# Altium project UmTRXv2_RxSel.PRJPCB
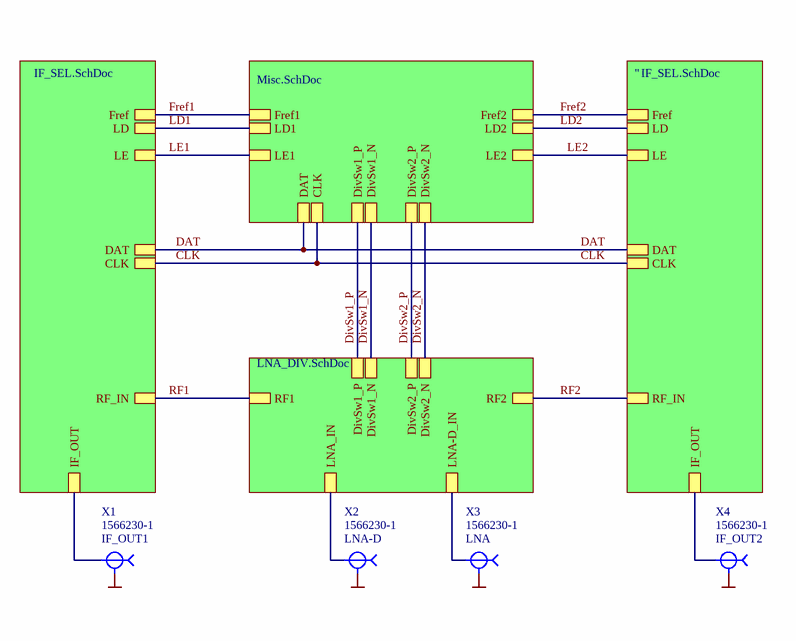
[diagram p0: Total.SCHDOC]
4 sheets, 225 parts. Net scope: hierarchical (ports join the sheet entries above them; power ports are global).
Board file: UmTRXv2_RxSel.PcbDoc
Sheets:
  Total.SCHDOC
     = Misc.SchDoc
    " = IF_SEL.SchDoc
     = IF_SEL.SchDoc
     = LNA_DIV.SchDoc

## Sheet Total.SCHDOC
size A4 portrait; CompanyName: FairWaves LLC; DrawnBy: Andrey Sviyazov; DocumentNumber: 1; Revision: 1; SheetNumber: 1; SheetTotal: 5; PageSetup: Record=PageOptionsZCenterHorizontal=TrueZCenterVertical=TrueZPrintScale=0.71ZXCorrection=1.00ZYCorrection=1.00ZPrintKind=2ZBorderSize=5000000ZLeftOffset=0ZBottomOffset=0ZOrientation=1ZPaperLength=1000ZPaperWidth=1000ZScale=100ZPaperSource=7ZPrintQuality=-4ZMediaType=1ZDitherType=10ZPaperKind=A4ZPrintScaleMode=1

### Parts
X1  1566230-1  Dscription: IF_OUT1  [U_FL]
X2  1566230-1  Dscription: LNA-D  [U_FL]
X3  1566230-1  Dscription: LNA  [U_FL]
X4  1566230-1  Dscription: IF_OUT2  [U_FL]

### Sub-sheets
" = IF_SEL.SchDoc: DAT, CLK, LE, Fref, LD, RF_IN, IF_OUT
? = Misc.SchDoc: DAT, CLK, LE1, Fref1, LD1, DivSw1_P, DivSw1_N, DivSw2_N, DivSw2_P, LE2, Fref2, LD2
? = IF_SEL.SchDoc: DAT, CLK, LE, Fref, LD, RF_IN, IF_OUT
? = LNA_DIV.SchDoc: DivSw2_P, DivSw1_N, DivSw1_P, RF1, RF2, DivSw2_N, LNA_IN, LNA-D_IN

### Nets
GND: X1.2(GND) X2.2(GND) X3.2(GND) X4.2(GND)
CLK: sheet /CLK, sheet "/CLK, sheet /CLK
DAT: sheet /DAT, sheet "/DAT, sheet /DAT
DivSw1_N: sheet /DivSw1_N, sheet /DivSw1_N
DivSw1_P: sheet /DivSw1_P, sheet /DivSw1_P
DivSw2_N: sheet /DivSw2_N, sheet /DivSw2_N
DivSw2_P: sheet /DivSw2_P, sheet /DivSw2_P
Fref1: sheet /Fref1, sheet /Fref
Fref2: sheet /Fref2, sheet "/Fref
IF_OUT: X1.1 ; sheet /IF_OUT
IF_OUT: X4.1 ; sheet "/IF_OUT  [a separate net that carries the same name]
LD1: sheet /LD1, sheet /LD
LD2: sheet /LD2, sheet "/LD
LE1: sheet /LE1, sheet /LE
LE2: sheet /LE2, sheet "/LE
LNA-D_IN: X3.1 ; sheet /LNA-D_IN
LNA_IN: X2.1 ; sheet /LNA_IN
RF1: sheet /RF_IN, sheet /RF1
RF2: sheet "/RF_IN, sheet /RF2

### Library data of the parts
X1-X4 = U_FL: Connector (UMCC); Manufacturer: Tyco Electronics Corp; Name: 1566230-1

## Sheet Misc.SchDoc
size A4 portrait; CompanyName: FairWaves LLC; DrawnBy: Andrey Sviyazov; DocumentNumber: 2; Revision: 1; SheetNumber: 2; SheetTotal: 5
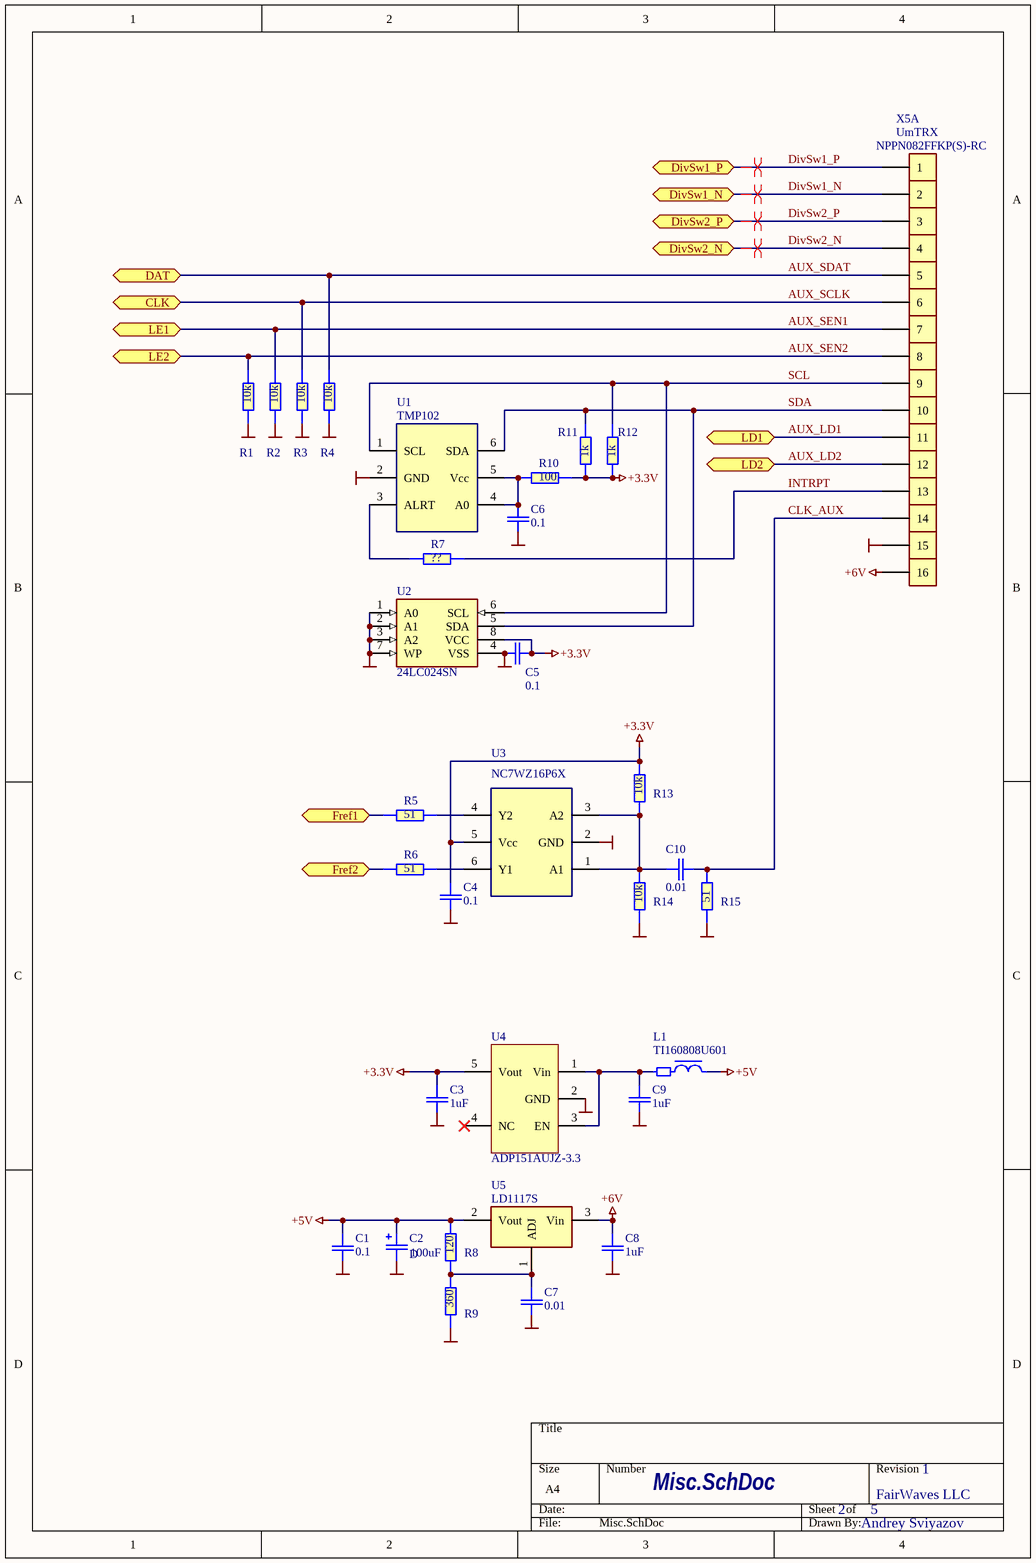
[diagram p1: Misc.SchDoc]

### Parts
C1  0.1  [C0603-Phillips]
C2  100uF  [cd7343]
C3  1uF  [C0603-Phillips]
C4  0.1  [C0603-Phillips]
C5  0.1  [C0603-Phillips]
C6  0.1  [C0603-Phillips]
C7  0.01  [C0603-Phillips]
C8  1uF  [C0603-Phillips]
C9  1uF  [C0603-Phillips]
C10  0.01  [C0603-Phillips]
L1  TI160808U601  [Ti160808-Phillips]
R1  10k  [R0603-PHILLIPS]
R2  10k  [R0603-PHILLIPS]
R3  10k  [R0603-PHILLIPS]
R4  10k  [R0603-PHILLIPS]
R5  51  [R0603-PHILLIPS]
R6  51  [R0603-PHILLIPS]
R7  ??  [R0603-PHILLIPS]
R8  120  [R0603-PHILLIPS]
R9  360  [R0603-PHILLIPS]
R10  100  [R0603-PHILLIPS]
R11  1k  [R0603-PHILLIPS]
R12  1k  [R0603-PHILLIPS]
R13  10k  [R0603-PHILLIPS]
R14  10k  [R0603-PHILLIPS]
R15  51  [R0603-PHILLIPS]
U1  TMP102  [PDSO-G6]
U2  24LC024SN  [SOIC8]
U3  NC7WZ16P6X  [SC70-6LD(SOT363)]
U4  ADP151AUJZ-3.3  [SOT-23-5[3.1x1.8/0.95]]
U5  LD1117S  [SOT-223-1]
X5  NPPN082FFKP(S)-RC  Misc: UmTRX  [NPPN082FFKP(S)]  (parts A,B,C,D,E,F,G,H,I,J,K,L,M,N,O,P of 16)

### Ports
CLK, DAT, DivSw1_N, DivSw1_P, DivSw2_N, DivSw2_P, Fref1, Fref2, LD1, LD2, LE1, LE2

### Nets
+3.3V: C3.2 C4.2 C5.2 R10.2 R11.1 R12.1 R13.1 U2.8(VCC) U3.5(Vcc) U4.5(Vout)
+5V: C1.2 C2.1(+) L1.1 R8.1 U5.2(Vout)
+6V: C8.2 U5.3(Vin) X5.16
GND: C1.1 C2.2(-) C3.1 C4.1 C5.1 C6.1 C7.1 C8.1 C9.1 R1.1 R2.1 R3.1 R4.1 R9.2 R14.2 R15.2 U1.2(GND) U2.1(A0) U2.2(A1) U2.3(A2) U2.4(VSS) U2.7(WP) U3.2(GND) U4.2(GND) X5.15
AUX_LD1: X5.11 ; port LD1  [project net LD1]
AUX_LD2: X5.12 ; port LD2  [project net LD2]
AUX_SCLK: R3.2 X5.6 ; port CLK  [project net CLK]
AUX_SDAT: R4.2 X5.5 ; port DAT  [project net DAT]
AUX_SEN1: R2.2 X5.7 ; port LE1  [project net LE1]
AUX_SEN2: R1.2 X5.8 ; port LE2  [project net LE2]
CLK_AUX: C10.1 R15.1 X5.14
DivSw1_N: X5.2 ; port DivSw1_N
DivSw1_P: X5.1 ; port DivSw1_P
DivSw2_N: X5.4 ; port DivSw2_N
DivSw2_P: X5.3 ; port DivSw2_P
Fref1: R5.1 ; port Fref1
Fref2: R6.1 ; port Fref2
INTRPT: R7.2 X5.13
SCL: R12.2 U1.1(SCL) U2.6(SCL) X5.9
SDA: R11.2 U1.6(SDA) U2.5(SDA) X5.10
NetC6_2: C6.2 R10.1 U1.4(A0) U1.5(Vcc)
NetC7_2: C7.2 R8.2 R9.1 U5.1(ADJ)
NetC9_2: C9.2 L1.2 U4.1(Vin) U4.3(EN)
NetC10_2: C10.2 R13.2 R14.1 U3.1(A1) U3.3(A2)
NetR5_2: R5.2 U3.4(Y2)
NetR6_2: R6.2 U3.6(Y1)
NetR7_1: R7.1 U1.3(ALRT)

Not connected (* = marked no-connect by the designer): U4 4(NC)*

### Layout directives
differential pair: DivSw1_N, DivSw1_P, DivSw2_N, DivSw2_P

### Notes on the sheet
- (in symbol CD7343) D

### Library data of the parts
C1 C3-C10 = C0603: Capacitor; Manufacturer: MURATA; Tolerance: 20%; Name: SMD0603; U/P/TKE: Y5V
  C1 C4-C6: Value: 0.1
  C3 C8 C9: Value: 1uF
  C7 C10: Value: 0.01
C2 = CD7343: Capacitor; Manufacturer: SPRAGUE; Name: CASE-D; U/P/TKE: 16V; Value: 100uF
L1 = TI160808: Choke; Manufacturer: MURATA; Name: TI160808U601; Value: *
R1-R15 = R0603: Resistor; Manufacturer: YAGEO; Tolerance: 5%; Name: SMD0603; U/P/TKE: 0.1W
  R1-R4 R13 R14: Value: 10k
  R5 R6 R15: Value: 51
  R7: Value: ??
  R8: Value: 120
  R9: Value: 360
  R10: Value: 100
  R11 R12: Value: 1k
U1 = TMP102: IC; Manufacturer: TI; Misc: Temperature Sensor I2C; Name: TMP102
U2 = AT24CXX: EEPROM; Manufacturer: Microchip; Swap: No; Name: 24LC024SN
U3 = NC7WZ16P6X: IC; Manufacturer: Fairchild; Name: NC7WZ16P6X
U4 = ADP151AUJZ: IC; Manufacturer: AD; Name: ADP151AUJZ-3.3
U5 = LD1117ADJ: IC; Manufacturer: STMicro; Swap: No; Name: LD1117S
X5 = NPPN082FFKP(S): Connector female 2mm SMD; Manufacturer: Sullins; Name: NPPN082FFKP(S)-RC

## Sheet IF_SEL.SchDoc
size A4 portrait; CompanyName: FairWaves LLC; DrawnBy: Andrey Sviyazov; DocumentNumber: 4; Revision: 1; SheetNumber: 4; SheetTotal: 5
Used 2 times, as channels ", . Parts and nets are listed once, with the designators drawn on the sheet.
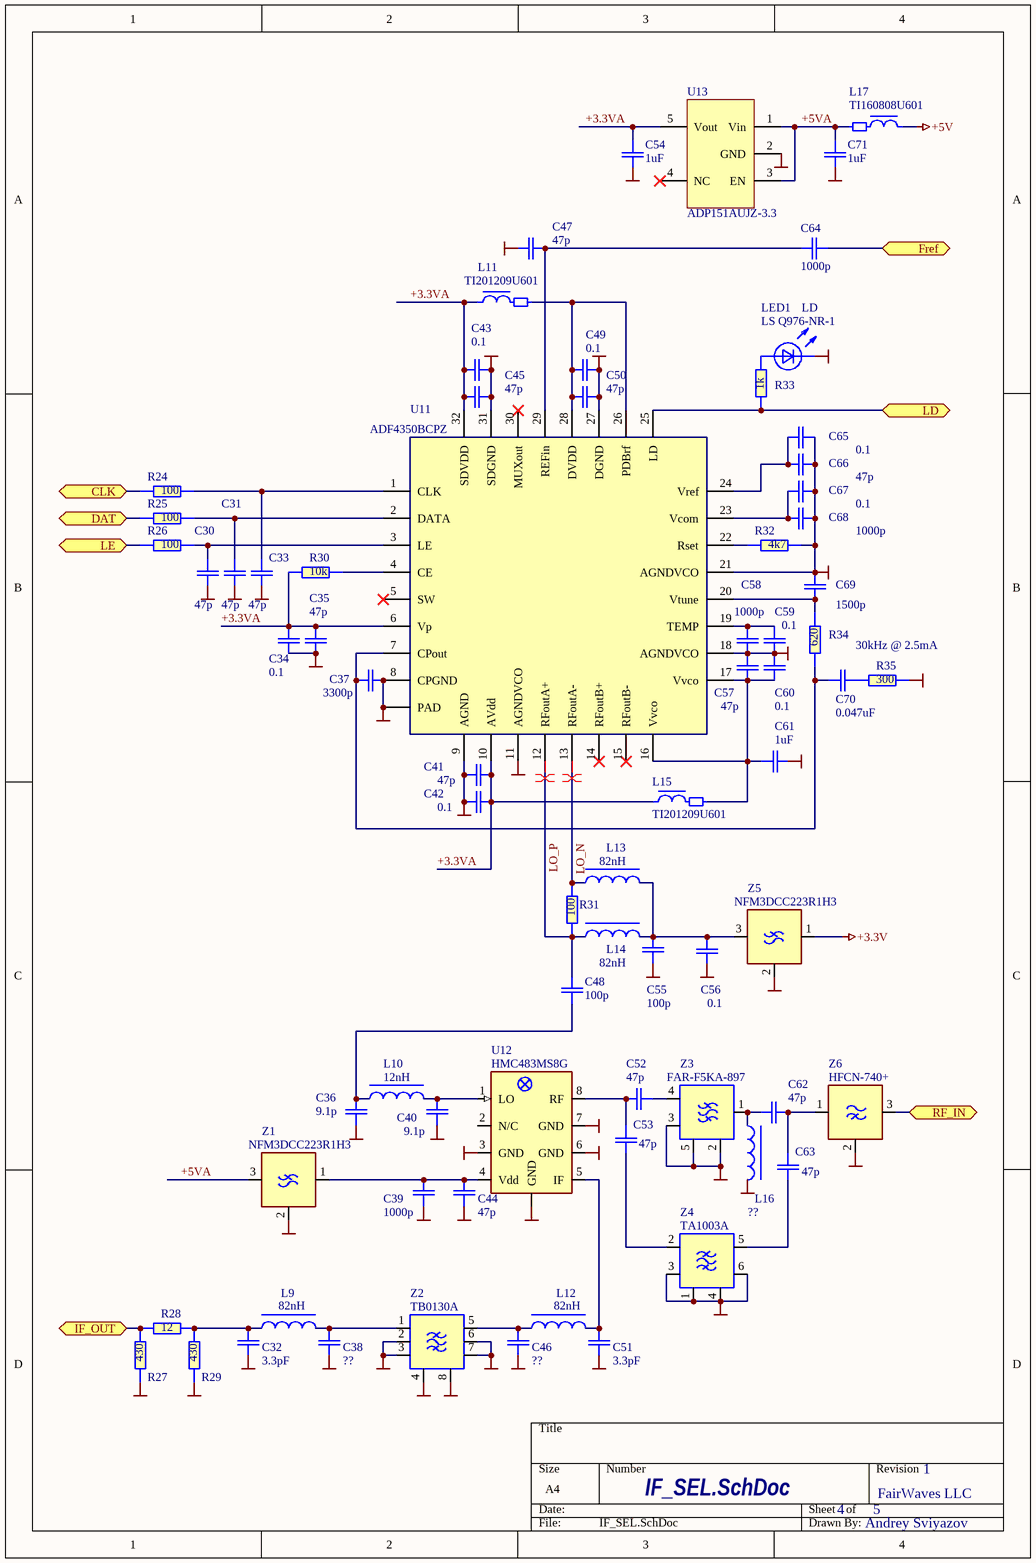
[diagram p2: IF_SEL.SchDoc]

### Parts
C30  47p  [C0603-Phillips]
C31  47p  [C0603-Phillips]
C32  3.3pF  [C0603-Phillips]
C33  47p  [C0603-Phillips]
C34  0.1  [C0603-Phillips]
C35  47p  [C0603-Phillips]
C36  9.1p  [C0603-Phillips]
C37  3300p  [C0603-Phillips]
C38  ??  [C0603-Phillips]
C39  1000p  [C0603-Phillips]
C40  9.1p  [C0603-Phillips]
C41  47p  [C0603-Phillips]
C42  0.1  [C0603-Phillips]
C43  0.1  [C0603-Phillips]
C44  47p  [C0603-Phillips]
C45  47p  [C0603-Phillips]
C46  ??  [C0603-Phillips]
C47  47p  [C0603-Phillips]
C48  100p  [C0603-Phillips]
C49  0.1  [C0603-Phillips]
C50  47p  [C0603-Phillips]
C51  3.3pF  [C0603-Phillips]
C52  47p  [C0603-Phillips]
C53  47p  [C0603-Phillips]
C54  1uF  [C0603-Phillips]
C55  100p  [C0603-Phillips]
C56  0.1  [C0603-Phillips]
C57  47p  [C0603-Phillips]
C58  1000p  [C0603-Phillips]
C59  0.1  [C0603-Phillips]
C60  0.1  [C0603-Phillips]
C61  1uF  [C0603-Phillips]
C62  47p  [C0603-Phillips]
C63  47p  [C0603-Phillips]
C64  1000p  [C0603-Phillips]
C65  0.1  [C0603-Phillips]
C66  47p  [C0603-Phillips]
C67  0.1  [C0603-Phillips]
C68  1000p  [C0603-Phillips]
C69  1500p  [C0603-Phillips]
C70  0.047uF  [C0603-Phillips]
C71  1uF  [C0603-Phillips]
L9  82nH  [TF160808-Phillips]
L10  12nH  [TF160808-Phillips]
L11  TI201209U601  [TI2012-Phillips]
L12  82nH  [TF160808-Phillips]
L13  82nH  [TF160808-Phillips]
L14  82nH  [TF160808-Phillips]
L15  TI201209U601  [TI2012-Phillips]
L16  ??  [TF160808-Phillips]
L17  TI160808U601  [Ti160808-Phillips]
LED1  LS Q976-NR-1  Misc: LD  [LED-0603y]
R24  100  [R0603-PHILLIPS]
R25  100  [R0603-PHILLIPS]
R26  100  [R0603-PHILLIPS]
R27  430  [R0603-PHILLIPS]
R28  12  [R0603-PHILLIPS]
R29  430  [R0603-PHILLIPS]
R30  10k  [R0603-PHILLIPS]
R31  100  [R0603-PHILLIPS]
R32  4k7  [R0603-PHILLIPS]
R33  1k  [R0603-PHILLIPS]
R34  620  [R0603-PHILLIPS]
R35  300  [R0603-PHILLIPS]
U11  ADF4350BCPZ  [CP-32-2]
U12  HMC483MS8G  [MS8G]
U13  ADP151AUJZ-3.3  [SOT-23-5[3.1x1.8/0.95]]
Z1  NFM3DCC223R1H3  [NFM3DC]
Z2  TB0130A  [DCC8_5x5]
Z3  FAR-F5KA-897  [SAW-1.4x1x0.5mm]
Z4  TA1003A  [DCC6C_L]
Z5  NFM3DCC223R1H3  [NFM3DC]
Z6  HFCN-740+  [LFCN-HFCN]

### Ports
CLK, DAT, Fref, IF_OUT, LD, LE, RF_IN

### Nets
+3.3V: Z5.1
+5V: L17.1
GND: C30.1 C31.1 C32.1 C33.1 C34.1 C35.1 C36.2 C37.1 C38.1 C39.2 C40.2 C41.2 C42.2 C43.2 C44.2 C45.2 C46.1 C47.1 C49.2 C50.2 C51.1 C54.1 C55.2 C56.1 C57.2 C58.1 C59.1 C60.2 C61.1 C65.2 C66.2 C67.2 C68.2 C69.2 C71.1 L16.2 LED1.1(K) R27.1 R29.1 R32.2 R35.2 U11.0(PAD) U11.8(CPGND) U11.9(AGND) U11.11(AGNDVCO) U11.18(AGNDVCO) U11.21(AGNDVCO) U11.27(DGND) U11.31(SDGND) U12.0(GND) U12.3(GND) U12.6(GND) U12.7(GND) U13.2(GND) Z1.2 Z2.2(In2) Z2.3(In3) Z2.4(Gnd) Z2.6(Out2) Z2.7(Out3) Z2.8(Gnd) Z3.2(GND) Z3.3(~{Out}) Z3.5(GND) Z4.1(GND) Z4.3(GND) Z4.4(GND) Z4.6(GND) Z5.2 Z6.2
+3.3VA: C34.2 C35.2 C41.1 C42.1 C43.1 C45.1 C54.2 L11.1 L15.1 R30.1 U11.6(Vp) U11.10(AVdd) U11.32(SDVDD) U13.5(Vout)
+5VA: C71.2 L17.2 U13.1(Vin) U13.3(EN) Z1.3
CLK: R24.1 ; port CLK
DAT: R25.1 ; port DAT
Fref: C64.2 ; port Fref
IF_OUT: R27.2 R28.1 ; port IF_OUT
LD: R33.1 U11.25(LD) ; port LD
LE: R26.1 ; port LE
LO_N: L13.1 R31.2 U11.13(RFoutA-)
LO_P: C48.1 L14.1 R31.1 U11.12(RFoutA+)
RF_IN: Z6.3 ; port RF_IN
NetC30_2: C30.2 R26.2 U11.3(LE)
NetC31_2: C31.2 R25.2 U11.2(DATA)
NetC32_2: C32.2 L9.1 R28.2 R29.2
NetC33_2: C33.2 R24.2 U11.1(CLK)
NetC36_1: C36.1 C48.2 L10.2
NetC37_2: C37.2 C70.2 R34.1 U11.7(CPout)
NetC38_2: C38.2 L9.2 Z2.1(IN1)
NetC39_1: C39.1 C44.1 U12.4(Vdd) Z1.1
NetC40_1: C40.1 L10.1 U12.1(LO)
NetC46_2: C46.2 L12.1 Z2.5(Out1)
NetC47_2: C47.2 C64.1 U11.29(REFin)
NetC49_1: C49.1 C50.1 L11.2 U11.26(PDBrf) U11.28(DVDD)
NetC51_2: C51.2 L12.2 U12.5(IF)
NetC52_1: C52.1 C53.2 U12.8(RF)
NetC52_2: C52.2 Z3.4(Out)
NetC53_1: C53.1 Z4.2(IN)
NetC55_1: C55.1 C56.2 L13.2 L14.2 Z5.3
NetC57_1: C57.1 C60.1 C61.2 L15.2 U11.16(Vvco) U11.17(Vvco)
NetC58_2: C58.2 C59.2 U11.19(TEMP)
NetC62_1: C62.1 L16.1 Z3.1(IN)
NetC62_2: C62.2 C63.2 Z6.1
NetC63_1: C63.1 Z4.5(Out)
NetC65_1: C65.1 C66.1 U11.24(Vref)
NetC67_1: C67.1 C68.1 U11.23(Vcom)
NetC69_1: C69.1 R34.2 U11.20(Vtune)
NetC70_1: C70.1 R35.1
NetLED1_2: LED1.2(A) R33.2
NetR30_2: R30.2 U11.4(CE)
NetR32_1: R32.1 U11.22(Rset)

Not connected (* = marked no-connect by the designer): U11 5(SW)* 14(RFoutB+)* 15(RFoutB-)* 30(MUXout)*; U12 2(N/C); U13 4(NC)*

### Channels
": designators end in -1; ports CLK=CLK DAT=DAT Fref=Fref2 IF_OUT=IF_OUT LD=LD2 LE=LE2 RF_IN=RF2
(top): designators end in -2; ports CLK=CLK DAT=DAT Fref=Fref1 IF_OUT=IF_OUT LD=LD1 LE=LE1 RF_IN=RF1

### Layout directives
differential pair: LO_N_", LO_P_"

### Notes on the sheet
- 30kHz @ 2.5mA

### Library data of the parts
C30-C33 C35-C41 C44-C48 C50-C53 C55 C57 C58 C62-C64 C66 C68 C69 = C0603: Capacitor; Manufacturer: MURATA; Tolerance: 20%; Name: SMD0603; U/P/TKE: NP0
  C30 C31 C33 C35 C41 C44 C45 C47 C50 C52 C53 C57 C62 C63 C66: Value: 47p
  C32 C51: Value: 3.3pF
  C36 C40: Value: 9.1p
  C37: Value: 3300p
  C38 C46: Value: ??
  C39 C58 C64 C68: Value: 1000p
  C48 C55: Value: 100p
  C69: Value: 1500p
C34 C42 C43 C49 C54 C56 C59-C61 C65 C67 C71 = C0603: as C1 on sheet Misc
  C34 C42 C43 C49 C56 C59 C60 C65 C67: Value: 0.1
  C54 C61 C71: Value: 1uF
C70 = C0603: Capacitor; Manufacturer: MURATA; Tolerance: 20%; Name: SMD0603; U/P/TKE: X5R; Value: 0.047uF
L9 L10 L12-L14 L16 = TF160808: Coil; Manufacturer: SMD; Name: TF160808
  L9 L12-L14: Value: 82nH
  L10: Value: 12nH
  L16: Value: ??
L11 L15 = TI2012_1: Choke; Manufacturer: MURATA; Name: TI201209U601; Value: *
L17 = TI160808: Choke; Manufacturer: MURATA; Name: TI160808U601; Value: *
LED1 = LED0603: LED SMD; Manufacturer: OSRAM Opto Semi; Name: LS Q976-NR-1
R24-R35 = R0603: as R1 on sheet Misc
  R24-R26 R31: Value: 100
  R27 R29: Value: 430
  R28: Value: 12
  R30: Value: 10k
  R32: Value: 4k7
  R33: Value: 1k
  R34: Value: 620
  R35: Value: 300
U11 = ADF4350BCPZ: IC; Manufacturer: Analog Devices; Misc: RF Synthesizer with VCO; Swap: No; Name: ADF4350BCPZ
U12 = HMC483_5MS8G: IC; Manufacturer: Hittite; Swap: No; Misc: High IP3 Mixer with  LO Amp; Name: HMC483MS8G
U13 = ADP151AUJZ: IC; Manufacturer: AD; Name: ADP151AUJZ-3.3
Z1 Z5 = NFM3DC: EMI_FILTER; Manufacturer: Murata; Value: 22nF; PDF: D:\Proj\Components\Murata\EMI Suppression Filters.pdf; Name: NFM3DCC223R1H3; Misc: EMI_FILTER
Z2 = SAW 5x5-8 SMD: SAW filter; Manufacturer: Tai-SAW; Misc: Low-Loss IF Filter for Mobile Communication; Name: TB0130A
Z3 = SAW 1.4x1.0-5 SMD: SAW Filter; Manufacturer: Taiyo Yuden; Misc: Low-Loss Filter for Mobile Communication; Name: FAR-F5KA-897
Z4 = SAW 3x3 SMD: SAW filter; Manufacturer: Tai-SAW; Misc: Low-Loss Filter for Mobile Communication; Name: TA1003A
Z6 = HFCN-2700: High pass filter; Manufacturer: MiniCircuits; Misc: HPF-740МГц; Name: HFCN-740+; Value: HFCN-740+

## Sheet LNA_DIV.SchDoc
size A4 portrait; CompanyName: FairWaves LLC; DrawnBy: Andrey Sviyazov; DocumentNumber: 3; Revision: 1; SheetNumber: 3; SheetTotal: 5
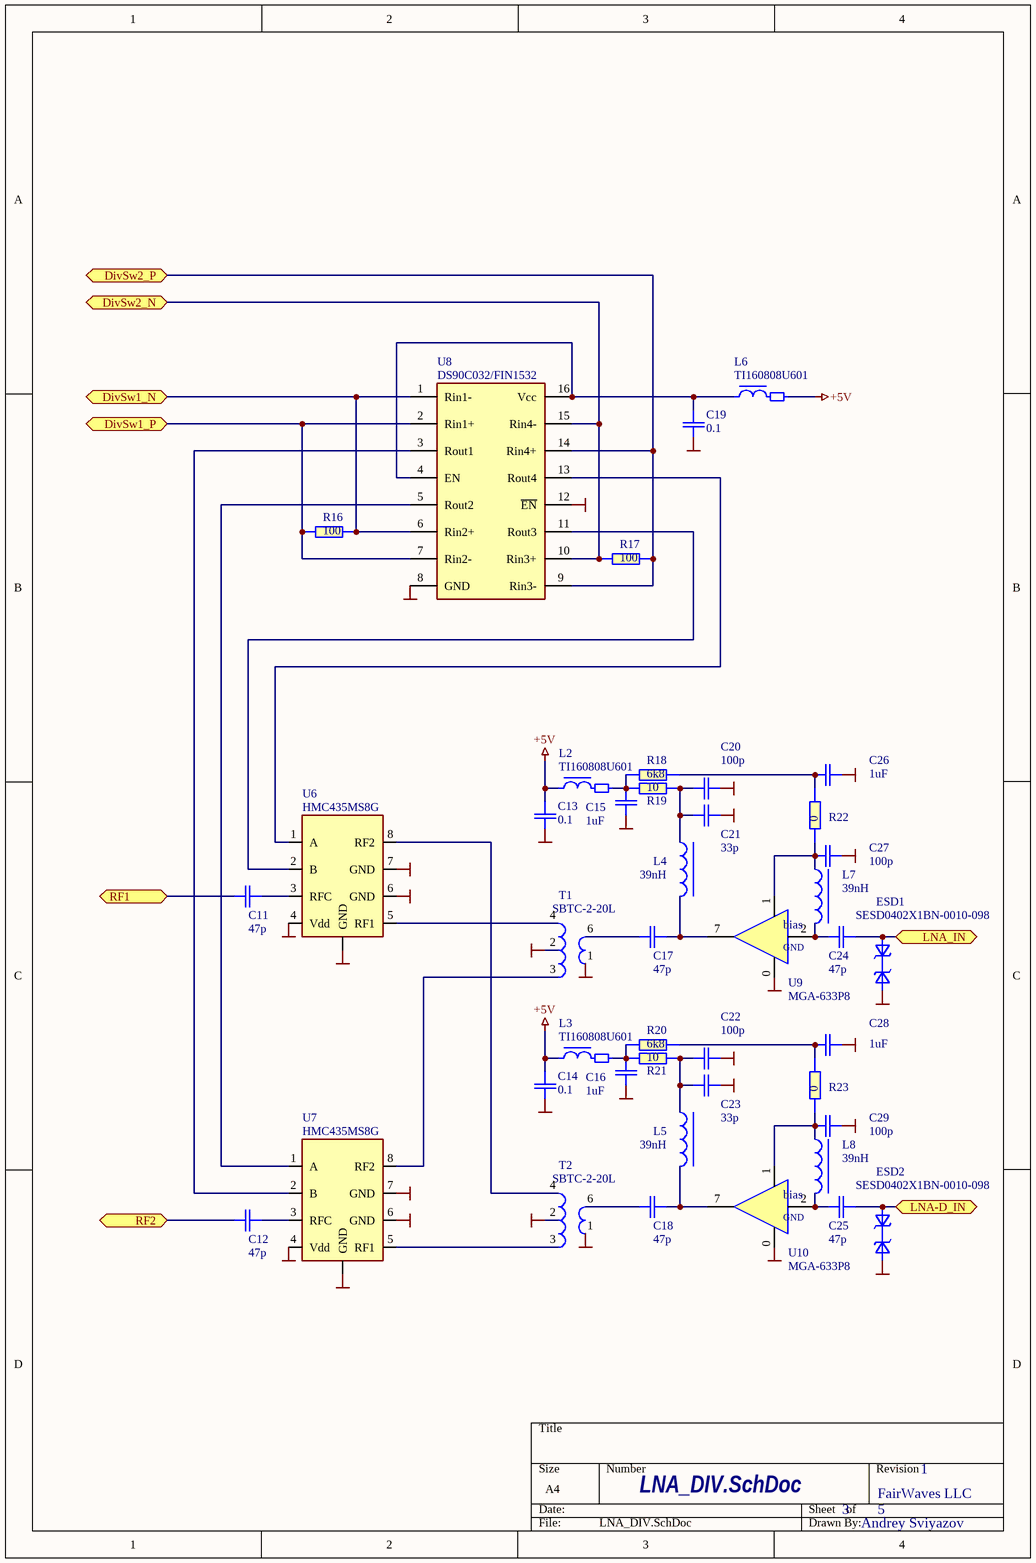
[diagram p3: LNA_DIV.SchDoc]

### Parts
C11  47p  [C0603-PHILLIPS]
C12  47p  [C0603-PHILLIPS]
C13  0.1  [C0603-Phillips]
C14  0.1  [C0603-Phillips]
C15  1uF  [C0603-Phillips]
C16  1uF  [C0603-Phillips]
C17  47p  [C0603-PHILLIPS]
C18  47p  [C0603-PHILLIPS]
C19  0.1  [C0603-Phillips]
C20  100p  [C0603-PHILLIPS]
C21  33p  [C0603-PHILLIPS]
C22  100p  [C0603-PHILLIPS]
C23  33p  [C0603-PHILLIPS]
C24  47p  [C0603-PHILLIPS]
C25  47p  [C0603-PHILLIPS]
C26  1uF  [C0603-Phillips]
C27  100p  [C0603-PHILLIPS]
C28  1uF  [C0603-Phillips]
C29  100p  [C0603-PHILLIPS]
ESD1  SESD0402X1BN-0010-098  [R0402-Phillips]
ESD2  SESD0402X1BN-0010-098  [R0402-Phillips]
L2  TI160808U601  [Ti160808-Phillips]
L3  TI160808U601  [Ti160808-Phillips]
L4  39nH  [TF160808-Phillips]
L5  39nH  [TF160808-Phillips]
L6  TI160808U601  [Ti160808-Phillips]
L7  39nH  [TF160808-Phillips]
L8  39nH  [TF160808-Phillips]
R16  100  [R0603-PHILLIPS]
R17  100  [R0603-PHILLIPS]
R18  6k8  [R0603-PHILLIPS]
R19  10  [R0603-PHILLIPS]
R20  6k8  [R0603-PHILLIPS]
R21  10  [R0603-PHILLIPS]
R22  0  [R0603-PHILLIPS]
R23  0  [R0603-PHILLIPS]
T1  SBTC-2-20L  [AT1030]
T2  SBTC-2-20L  [AT1030]
U6  HMC435MS8G  [MS8G]
U7  HMC435MS8G  [MS8G]
U8  DS90C032/FIN1532  [SOIC16]
U9  MGA-633P8  [SLP2x2]
U10  MGA-633P8  [SLP2x2]

### Ports
DivSw1_N, DivSw1_P, DivSw2_N, DivSw2_P, LNA-D_IN, LNA_IN, RF1, RF2

### Nets
+5V: C13.2 C14.2 L2.1 L3.1 L6.2
GND: C13.1 C14.1 C15.1 C16.1 C19.1 C20.2 C21.2 C22.2 C23.2 C26.2 C27.2 C28.2 C29.2 ESD1.1(A1) ESD2.1(A1) T1.1 T1.2 T2.1 T2.2 U6.0(GND) U6.4(Vdd) U6.6(GND) U6.7(GND) U7.0(GND) U7.4(Vdd) U7.6(GND) U7.7(GND) U8.8(GND) U8.12(~{EN}) U9.0(GND) U10.0(GND)
DivSw1_N: R16.2 U8.1(Rin1-) U8.6(Rin2+) ; port DivSw1_N
DivSw1_P: R16.1 U8.2(Rin1+) U8.7(Rin2-) ; port DivSw1_P
DivSw2_N: R17.1 U8.10(Rin3+) U8.15(Rin4-) ; port DivSw2_N
DivSw2_P: R17.2 U8.9(Rin3-) U8.14(Rin4+) ; port DivSw2_P
LNA-D_IN: C25.2 ESD2.2(A2) ; port LNA-D_IN
LNA_IN: C24.2 ESD1.2(A2) ; port LNA_IN
RF1: C11.1 ; port RF1
RF2: C12.1 ; port RF2
NetC11_2: C11.2 U6.3(RFC)
NetC12_2: C12.2 U7.3(RFC)
NetC15_2: C15.2 L2.2 R18.1 R19.1
NetC16_2: C16.2 L3.2 R20.1 R21.1
NetC17_1: C17.1 T1.6
NetC17_2: C17.2 L4.2 U9.7(RFout/VDD)
NetC18_1: C18.1 T2.6
NetC18_2: C18.2 L5.2 U10.7(RFout/VDD)
NetC19_2: C19.2 L6.1 U8.4(EN) U8.16(Vcc)
NetC20_1: C20.1 C21.1 L4.1 R19.2
NetC22_1: C22.1 C23.1 L5.1 R21.2
NetC24_1: C24.1 L7.2 U9.2(A)
NetC25_1: C25.1 L8.2 U10.2(A)
NetC26_1: C26.1 R18.2 R22.2
NetC27_1: C27.1 L7.1 R22.1 U9.1(BIAS)
NetC28_1: C28.1 R20.2 R23.2
NetC29_1: C29.1 L8.1 R23.1 U10.1(BIAS)
NetT1_3: T1.3 U7.8(RF2)
NetT1_4: T1.4 U6.5(RF1)
NetT2_3: T2.3 U7.5(RF1)
NetT2_4: T2.4 U6.8(RF2)
NetU6_1: U6.1(A) U8.13(Rout4)
NetU6_2: U6.2(B) U8.11(Rout3)
NetU7_1: U7.1(A) U8.5(Rout2)
NetU7_2: U7.2(B) U8.3(Rout1)

### Notes on the sheet
- (in symbol MGA-633P8) bias

### Library data of the parts
C11 C12 C17 C18 C20-C25 C27 C29 = C0603: as C30 on sheet IF_SEL
  C11 C12 C17 C18 C24 C25: Value: 47p
  C20 C22 C27 C29: Value: 100p
  C21 C23: Value: 33p
C13-C16 C19 C26 C28 = C0603: as C1 on sheet Misc
  C13 C14 C19: Value: 0.1
  C15 C16 C26 C28: Value: 1uF
ESD1 ESD2 = SESD0402X: ESD diod bi-directional; Manufacturer: Tyco Electronics Corp; U/P/TKE: 9.8V; Name: SESD0402X1BN-0010-098
L2 L3 L6 = TI160808: Choke; Manufacturer: MURATA; Name: TI160808U601; Value: *
L4 L5 L7 L8 = TF160808: Coil; Manufacturer: SMD; Name: TF160808; Value: 39nH
R16-R23 = R0603: as R1 on sheet Misc
  R16 R17: Value: 100
  R18 R20: Value: 6k8
  R19 R21: Value: 10
  R22 R23: Value: 0
T1 T2 = SBTC-2-10L: Transformer; Manufacturer: Mini-Cirquits; Name: SBTC-2-20L
U6 U7 = HMC435MS8G: IC; Manufacturer: Hittite; Swap: No; Misc: High IP3 Mixer with  LO Amp; Name: HMC435MS8G
U8 = DS90C032: IC; Manufacturer: National/Fairchild; Swap: No; Misc: Quad LVDS Receiver; Name: DS90C032/FIN1532
U9 U10 = MGA-633P8: IC; Manufacturer: Avago; Swap: No; Misc: Ultra Low Noise, High Linearity Active Bias Low Noise Amplifi er; PDF: d:\Proj\Components\Avago\MGA-633P8.pdf; Name: MGA-633P8

## Nets that join several sheets
+3.3V: Misc (10 pins), " (Z5-1.1),  (Z5-2.1)
+5V: Misc (5 pins), " (L17-1.1),  (L17-2.1), LNA_DIV (5 pins)
GND: Total (X1.2 X2.2 X3.2 X4.2), Misc (25 pins), " (70 pins),  (70 pins), LNA_DIV (31 pins)
CLK: Misc (R3.2 X5.6), " (R24-1.1),  (R24-2.1)
DAT: Misc (R4.2 X5.5), " (R25-1.1),  (R25-2.1)
DivSw1_N: Misc (X5.2), LNA_DIV (R16.2 U8.1 U8.6)
DivSw1_P: Misc (X5.1), LNA_DIV (R16.1 U8.2 U8.7)
DivSw2_N: Misc (X5.4), LNA_DIV (R17.1 U8.10 U8.15)
DivSw2_P: Misc (X5.3), LNA_DIV (R17.2 U8.9 U8.14)
Fref1: Misc (R5.1),  (C64-2.2)
Fref2: Misc (R6.1), " (C64-1.2)
IF_OUT: Total (X1.1),  (R27-2.2 R28-2.1)
IF_OUT: Total (X4.1), " (R27-1.2 R28-1.1)
LD1: Misc (X5.11),  (R33-2.1 U11-2.25)
LD2: Misc (X5.12), " (R33-1.1 U11-1.25)
LE1: Misc (R2.2 X5.7),  (R26-2.1)
LE2: Misc (R1.2 X5.8), " (R26-1.1)
LNA-D_IN: Total (X3.1), LNA_DIV (C25.2 ESD2.2)
LNA_IN: Total (X2.1), LNA_DIV (C24.2 ESD1.2)
RF1:  (Z6-2.3), LNA_DIV (C11.1)
RF2: " (Z6-1.3), LNA_DIV (C12.1)

## Assembly variants
UmTRX GSM Preselector_full: all parts fitted